# Altium schematic sheet 00 COVER.SchDoc
size A2
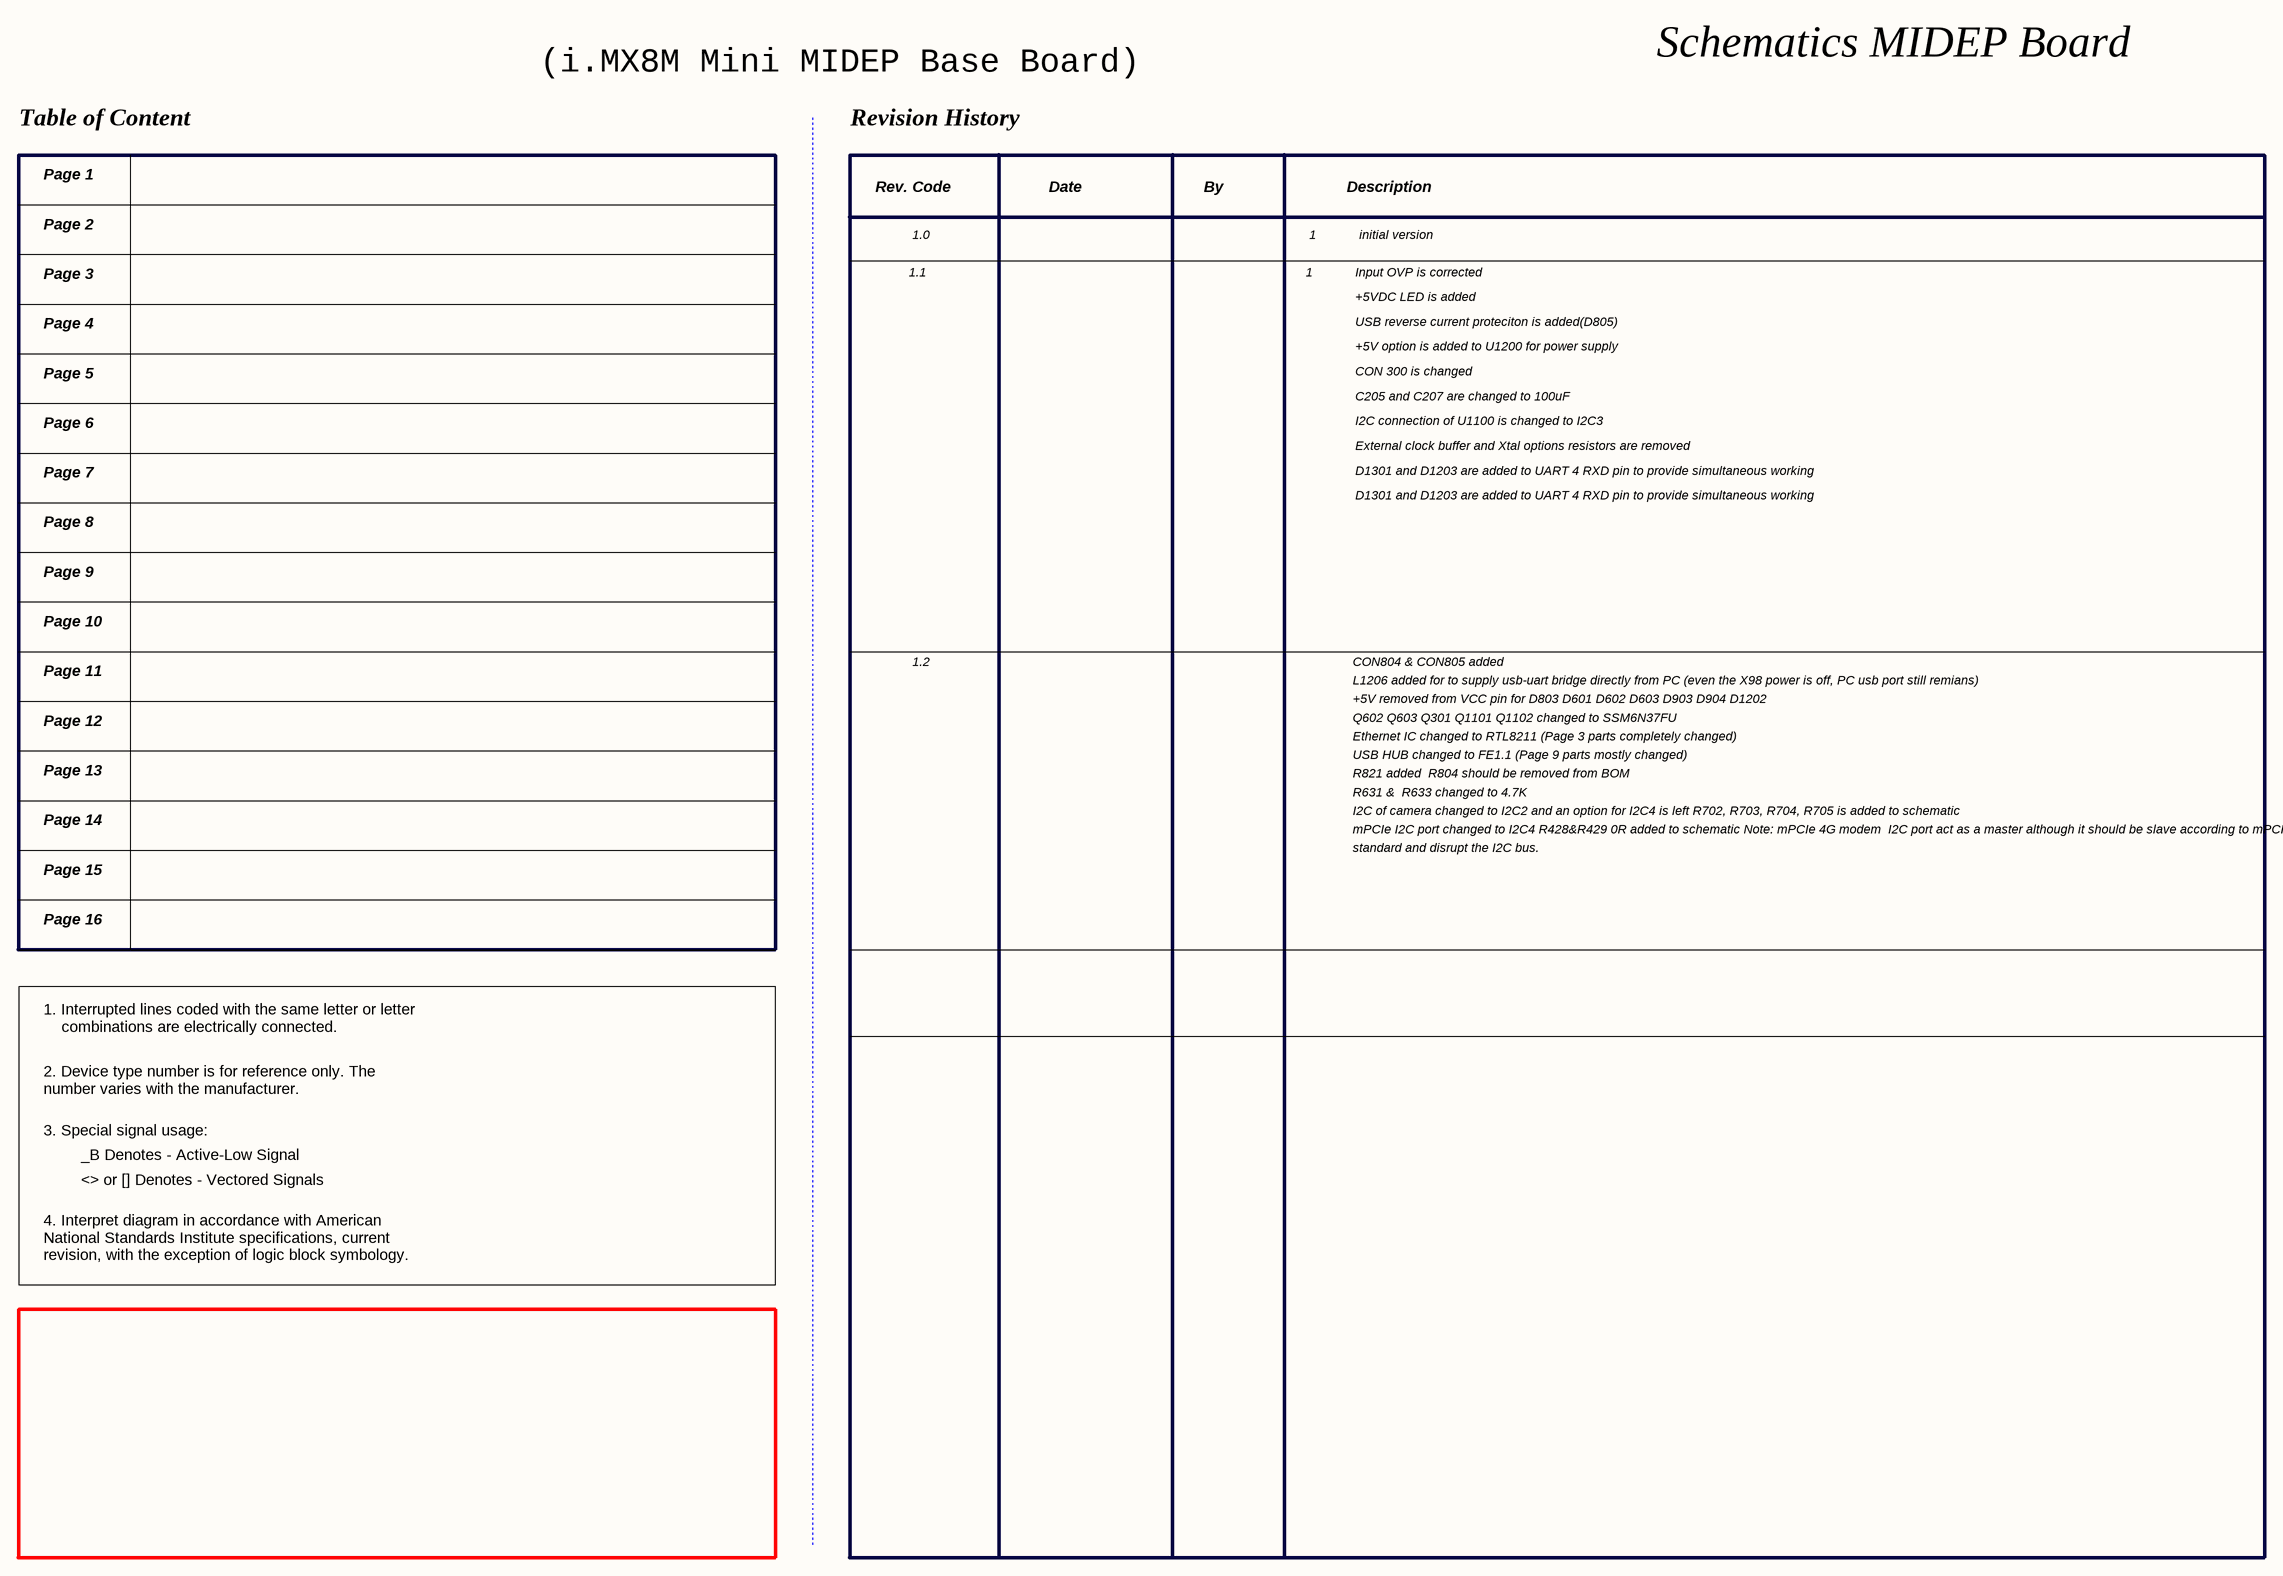
[diagram p0: 00 COVER.SchDoc]

## Notes on the sheet
- (i.MX8M Mini MIDEP Base Board)
- Schematics MIDEP Board
- Table of Content
- Revision History
- Page 1
- Rev. Code
- Date
- By
- Description
- Page 2
- 1.0
- 1
- initial version
- Page 3
- Page 4
- 1.1
- Input OVP is corrected
- +5VDC LED is added
- USB reverse current proteciton is added(D805)
- Page 5
- +5V option is added to U1200 for power supply
- CON 300 is changed
- Page 6
- C205 and C207 are changed to 100uF
- I2C connection of U1100 is changed to I2C3
- External clock buffer and Xtal options resistors are removed
- Page 7
- D1301 and D1203 are added to UART 4 RXD pin to provide simultaneous working
- Page 8
- Page 9
- Page 10
- Page 11
- 1.2
- CON804 & CON805 added
- L1206 added for to supply usb-uart bridge directly from PC (even the X98 power is off, PC usb port still remians)
- +5V removed from VCC pin for D803 D601 D602 D603 D903 D904 D1202
- Page 12
- Q602 Q603 Q301 Q1101 Q1102 changed to SSM6N37FU
- Ethernet IC changed to RTL8211 (Page 3 parts completely changed)
- USB HUB changed to FE1.1 (Page 9 parts mostly changed)
- Page 13
- Page 14
- R821 added  R804 should be removed from BOM
- R631 &  R633 changed to 4.7K
- I2C of camera changed to I2C2 and an option for I2C4 is left R702, R703, R704, R705 is added to schematic
- Page 15
- mPCIe I2C port changed to I2C4 R428&R429 0R added to schematic Note: mPCIe 4G modem  I2C port act as a master although it should be slave according to mPCIe
- standard and disrupt the I2C bus.
- Page 16
- 1. Interrupted lines coded with the same letter or letter
  combinations are electrically connected.
- 2. Device type number is for reference only. The
  number varies with the manufacturer.
- 3. Special signal usage:
- _B Denotes - Active-Low Signal
- <> or [] Denotes - Vectored Signals
- 4. Interpret diagram in accordance with American
  National Standards Institute specifications, current
  revision, with the exception of logic block symbology.
- Sheet Title:
- Project:
- Inventron
- Electronics and Software
- Size:
- Date:
- Drawn By:
- Revision:
- Checked By:
- A4
- Sheet
- Time:
- of
- Budotek Teknopark
- Dudullu OSB
- Des 2. Cadde No:8/30
- ©2020 Inventron Electronics and Software. All rights reserved.
- Umraniye / ISTANBUL